# Altium schematic sheet Sheet4.SchDoc: Наименование
size 209 x 297 mm; ApprovedBy: Утвердил; CheckedBy: Проверил; Author: Разработал; CompanyName: Организация; DrawnBy: Н.Контр; Engineer: Т.Контр; SheetNumber: 4; SheetTotal: 6; PageSetup: Record=PageOptions|CenterHorizontal=True|CenterVertical=True|PrintScale=0.94|XCorrection=1.00|YCorrection=1.00|PrintKind=1|BorderSize=5000000|LeftOffset=0|BottomOffset=0|Orientation=1|PaperLength=1000|PaperWidth=1000|Scale=100|PaperSource=7|PrintQuality=-4|MediaType=1|DitherType=10|PaperKind=A4|PrintScaleMode=1; DecimalNumber: Децимальный номер; HeadOfSector: Нач. сектора; MainDevice: Перв.примен.; Name: Наименование; DocumentName: Sheet1.SCHDOC
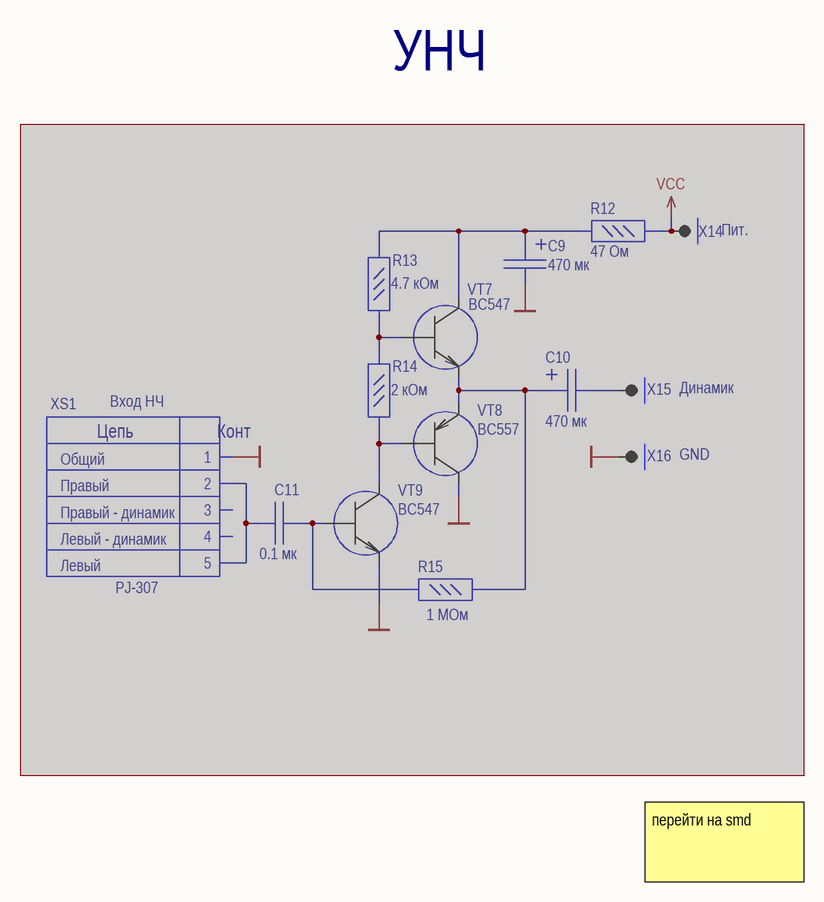
[diagram p0: Sheet4.SchDoc]

## Parts
C9  470 мк  [К50-35 - 8x11.5]  (masked out: inside a compile mask, not in the netlist)
C10  470 мк  [К50-35 - 8x11.5]  (masked out: inside a compile mask, not in the netlist)
C11  0.1 мк  [К10-17Б]  (masked out: inside a compile mask, not in the netlist)
R12  47 Ом  [С1-4]  (masked out: inside a compile mask, not in the netlist)
R13  4.7 кОм  [С1-4]  (masked out: inside a compile mask, not in the netlist)
R14  2 кОм  [С1-4]  (masked out: inside a compile mask, not in the netlist)
R15  1 МОм  [С1-4]  (masked out: inside a compile mask, not in the netlist)
VT7  BC547  [КТ-26]  (masked out: inside a compile mask, not in the netlist)
VT8  BC557  [КТ-26]  (masked out: inside a compile mask, not in the netlist)
VT9  BC547  [КТ-26]  (masked out: inside a compile mask, not in the netlist)
X14  КТ  [KT]  (value not drawn)  (masked out: inside a compile mask, not in the netlist)
X15  КТ  [KT]  (value not drawn)  (masked out: inside a compile mask, not in the netlist)
X16  КТ  [KT]  (value not drawn)  (masked out: inside a compile mask, not in the netlist)
XS1  PJ-307  [PJ-307]  (masked out: inside a compile mask, not in the netlist)

## Notes on the sheet
- УНЧ
- (near X14) Пит.
- Вход НЧ
- Динамик
- GND
- перейти на smd
- Подп. и дата
- Инв.№ дубл.
- Взам.инв.№
- Подп.и дата
- Инв.№ подл.
- Изм.
- Лист
- № докум.
- Подп.
- Дата
- Формат  A4
- (in symbol PJ-307) Цепь; Конт; Общий; Правый; Правый - динамик; Левый - динамик; Левый

## Library data of the parts
C9 C10 = K50-35
C11 = C_К10-17Б
R12-R15 = R_C1-4